# Altium schematic sheet BoardDesign.SchDoc
size Tabloid; SheetNumber: 1; SheetTotal: 1
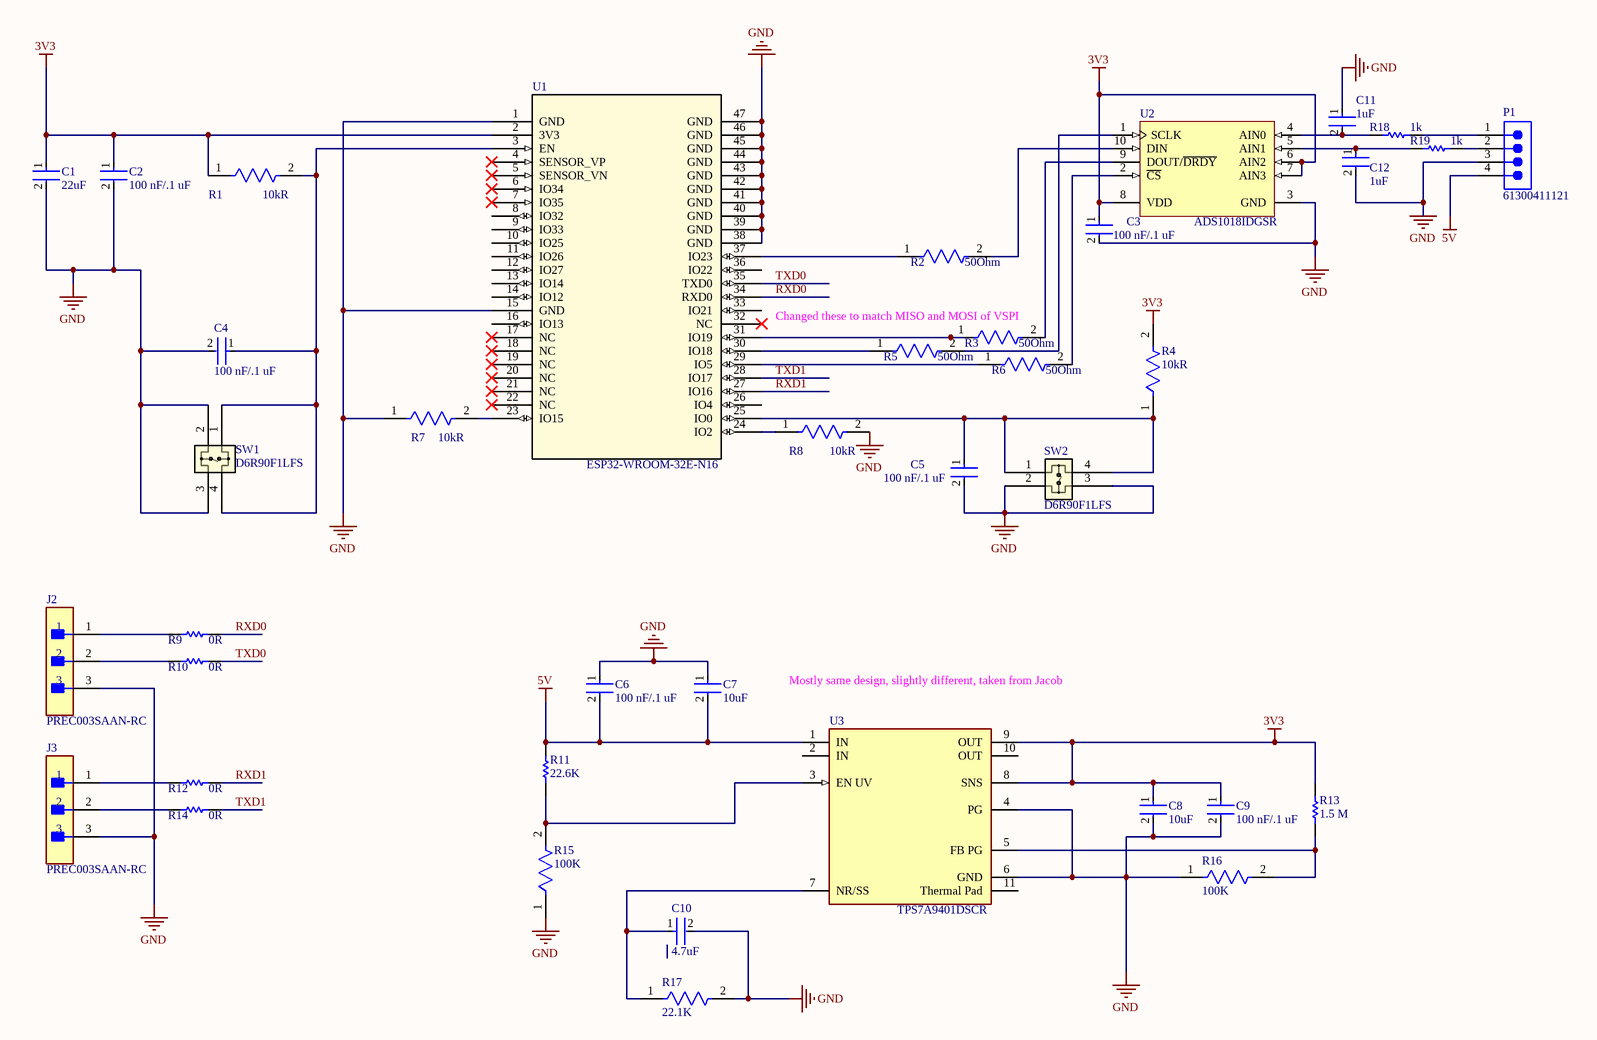
[diagram p0: BoardDesign.SchDoc]

## Parts
C1  22uF  [FP-CL21-IPC_A]
C2  100 nF/.1 uF  [FP-CC0805-0_85-MFG]
C3  100 nF/.1 uF  [FP-CC0805-0_85-MFG]
C4  100 nF/.1 uF  [FP-CC0805-0_85-MFG]
C5  100 nF/.1 uF  [FP-CC0805-0_85-MFG]
C6  100 nF/.1 uF  [FP-CC0805-0_85-MFG]
C7  10uF  [FP-CL21-IPC_B]
C8  10uF  [FP-CL21-IPC_B]
C9  100 nF/.1 uF  [FP-CC0805-0_85-MFG]
C10  4.7uF  [FP-CL21-IPC_A]
C11  1uF  [FP-CC0805-0_85-MFG]
C12  1uF  [FP-CC0805-0_85-MFG]
J2  PREC003SAAN-RC  [FP-PREC003SAAN-RC-MFG]
J3  PREC003SAAN-RC  [FP-PREC003SAAN-RC-MFG]
P1  61300411121  [61300411121]
R1  10kR  [FP-RR1220-IPC_A]
R2  50Ohm  [FP-D12-CRCW0805-MFG]
R3  50Ohm  [FP-D12-CRCW0805-MFG]
R4  10kR  [FP-RR1220-IPC_A]
R5  50Ohm  [FP-D12-CRCW0805-MFG]
R6  50Ohm  [FP-D12-CRCW0805-MFG]
R7  10kR  [FP-RR1220-IPC_A]
R8  10kR  [FP-RR1220-IPC_A]
R9  0R  [RESC2013X70X40NL20T20]
R10  0R  [RESC2013X70X40NL20T20]
R11  22.6K  [RESC2013X50X30LL20T20]
R12  0R  [RESC2013X70X40NL20T20]
R13  1.5 M  [RESC0805(2012)_N]
R14  0R  [RESC2013X70X40NL20T20]
R15  100K  [FP-RC0805-0_6-IPC_C]
R16  100K  [FP-RC0805-0_6-IPC_C]
R17  22.1K  [FP-RMCF0805-IPC_B]
R18  1k  [RESC2013X60X35ML10T20]
R19  1k  [RESC2013X60X35ML10T20]
SW1  D6R90F1LFS  [D6R_CNK]
SW2  D6R90F1LFS  [D6R_CNK]
U1  ESP32-WROOM-32E-N16  [ESP32-WROOM-32E_EXP]
U2  ADS1018IDGSR  [TI-DGS10_N]
U3  TPS7A9401DSCR  [FP-DSC0010J-MFG]

## Nets
3V3: C1.1 C2.1 C3.1 C8.1 C9.1 R1.1 R4.2 R13.2 U1.2(3V3) U2.6(AIN2) U2.7(AIN3) U2.8(VDD) U3.8(SNS) U3.9(OUT)
5V: C6.2 C7.2 P1.4 R11.1 U3.1(IN)
GND: C1.2 C2.2 C3.2 C4.2 C5.2 C6.1 C7.1 C8.2 C9.2 C10.2 C11.1 C12.2 J2.3 J3.3 P1.3 R7.1 R8.2 R15.1 R16.1 R17.2 SW1.2 SW1.3 SW2.2 SW2.3 U1.1(GND) U1.15(GND) U1.38(GND) U1.39(GND) U1.40(GND) U1.41(GND) U1.42(GND) U1.43(GND) U1.44(GND) U1.45(GND) U1.46(GND) U1.47(GND) U2.3(GND) U3.4(PG) U3.6(GND)
RXD0: R9.2 U1.34(RXD0)
RXD1: R12.2 U1.27(IO16)
TXD0: R10.2 U1.35(TXD0)
TXD1: R14.2 U1.28(IO17)
NetC4_1: C4.1 R1.2 SW1.1 SW1.4 U1.3(EN)
NetC5_1: C5.1 R4.1 SW2.1 SW2.4 U1.25(IO0)
NetC10_1: C10.1 R17.1 U3.7(NR/SS)
NetC11_2: C11.2 R18.1 U2.4(AIN0)
NetC12_1: C12.1 R19.1 U2.5(AIN1)
NetJ2_1: J2.1 R9.1
NetJ2_2: J2.2 R10.1
NetJ3_1: J3.1 R12.1
NetJ3_2: J3.2 R14.1
NetP1_1: P1.1 R18.2
NetP1_2: P1.2 R19.2
NetR2_1: R2.1 U1.37(IO23)
NetR2_2: R2.2 U2.10(DIN)
NetR3_1: R3.1 U1.31(IO19)
NetR3_2: R3.2 U2.9(DOUT/~{DRDY})
NetR5_1: R5.1 U1.30(IO18)
NetR5_2: R5.2 U2.1(SCLK)
NetR6_1: R6.1 U1.29(IO5)
NetR6_2: R6.2 U2.2(~{CS})
NetR7_2: R7.2 U1.23(IO15)
NetR8_1: R8.1 U1.24(IO2)
NetR11_2: R11.2 R15.2 U3.3(EN_UV)
NetR13_1: R13.1 R16.2 U3.5(FB_PG)

Not connected (* = marked no-connect by the designer): U1 4(SENSOR_VP)* 5(SENSOR_VN)* 6(IO34)* 7(IO35)* 8(IO32) 9(IO33) 10(IO25) 11(IO26) 12(IO27) 13(IO14) 14(IO12) 16(IO13) 17(NC)* 18(NC)* 19(NC)* 20(NC)* 21(NC)* 22(NC)* 26(IO4) 32(NC)* 33(IO21) 36(IO22); U3 2(IN) 10(OUT) 11(Thermal_Pad)

## Notes on the sheet
- (near R3) Changed these to match MISO and MOSI of VSPI
- Mostly same design, slightly different, taken from Jacob

## Library data of the parts
C1 = CMP-13271-000185-1: CL21 Series 0805 22uF 6.3V ±20% Tolerance X5R Multilayer Ceramic Chip Capacitor; Height: 1.25mm; Length: 2mm; Capacitance: 22uF; Mount: Surface Mount; Dielectric: X5R; Voltage Rating (DC): 6.3V; Case Code (Metric): 2012; Depth: 1.25mm; Max Operating Temperature: 85°C; Voltage Rating: 6.3V; Width: 0.049inch; Case/Package: 0805; Radiation Hardening: No; Thickness: 0.055inch; Packaging: Tape and Reel; Package Quantity: 2000; Lead Free: Lead Free; Contact Plating: Tin; Min Operating Temperature: -55°C; Case Code (Imperial): 0805; Tolerance: 20%
C2-C6 C9 = CMP-2100-03606-3: CAP CER 0.1UF 50V X7R 0805; Manufacturer Part Number: CC0805KRX7R9BB104; Manufacturer: Yageo; Tolerance: 0.1; Capacitance: 100 nF; Value: 100 nF; Material: Ceramic; Device Class L1: Passive Components; ComponentLink2Description: Datasheet; Package: CC0805-0.85; Digikey Description: CAP CER 0.1UF 50V X7R 0805; Device Class L3: Ceramic Capacitors; Temperature: -30°C to +85°C; Temperature Characteristic: X7R; Voltage Rating: 50 V; Height: 0.95mm; RoHS: TRUE; Ipc Land Pattern Name: CAPC200125X85; Device Class L2: Capacitors; Category: Cap; Temperature Range Low: -30°C; Temperature Range High: +85°C; Mouser Description: Multilayer Ceramic Capacitors MLCC - SMD/SMT 100nF 50V X7R 10%; Footprint Url: http://www.yageo.com/exep/pages/download/literatures/UPY-C_GEN_24.pdf; Automotive: No; Octopart: https://octopart.com/cc0805krx7r9bb104-yageo-192993; Lead Free: Yes; ComponentLink2URL: http://www.yageo.com/documents/recent/UPY-GPHC_Y5V_6.3V-to-50V_8.pdf
C7 C8 = CMP-2000-06102-2: CL21 Series 0805 10uF 16V ±10% Tolerance X5R Multilayer Ceramic Chip Capacitor; Dielectric: X7R; Length: 2mm; Depth: 1.25mm; Voltage: 16V; Width: 0.049inch; Capacitance: 10uF; Lead Free: Lead Free; Max Operating Temperature: 85°C; Mount: Surface Mount; Voltage Rating: 16V; Height: 1.25mm; Radiation Hardening: No; Packaging: Tape and Reel; Voltage Rating (DC): 16V; Thickness: 0.055inch; Case/Package: 0805; Case Code (Imperial): 0805; Min Operating Temperature: -55°C; Case Code (Metric): 2012; Package Quantity: 1; Tolerance: 10%
C10 = CMP-13271-002624-1: CL21 Series 0805 4.7uF 25V ±10% Tolerance X5R Multilayer Ceramic Chip Capacitor; Case Code (Imperial): 0805; Thickness: 0.055inch; Mount: Surface Mount; Case Code (Metric): 2012; Capacitance: 4.7uF; Depth: 1.25mm; Lead Free: Lead Free; Case/Package: 0805; Voltage Rating: 25V; Package Quantity: 1; Width: 0.049inch; Radiation Hardening: No; Voltage Rating (DC): 25V; Length: 2mm; Dielectric: X5R; Height: 1.25mm; Packaging: Tape and Reel; Tolerance: 10%; Min Operating Temperature: -55°C; Max Operating Temperature: 85°C
C11 C12 = CMP-03422-000001-1: CAP CER 1UF 16V X7R 0805; Manufacturer: Yageo; Manufacturer Part Number: CC0805KKX7R7BB105; Material: Ceramic; Tolerance: 0.1; Voltage Rating: 16 V; Category: Cap; Capacitance: 1 uF; ComponentLink2Description: Datasheet; Automotive: No; Temperature Range High: +85°C; RoHS: TRUE; Footprint Url: http://www.yageo.com/exep/pages/download/literatures/UPY-C_GEN_24.pdf; Mouser Description: Multilayer Ceramic Capacitors MLCC - SMD/SMT 1.0uF 16V X7R 10%; Height: 0.95mm; Ipc Land Pattern Name: CAPC200125X85; Temperature: -30°C to +85°C; Lead Free: Yes; Value: 1 uF; Temperature Characteristic: X7R; Package: CC0805-0.85; Temperature Range Low: -30°C; Device Class L1: Passive Components; Device Class L3: Ceramic Capacitors; Octopart: https://octopart.com/cc0805kkx7r7bb105-yageo-8376555; ComponentLink2URL: http://www.yageo.com/documents/recent/UPY-GPHC_Y5V_6.3V-to-50V_8.pdf; Device Class L2: Capacitors; Digikey Description: CAP CER 1UF 16V X7R 0805
J2 J3 = CMP-00595-22265080-1: PREC003SAAN-RC Conn Header Vert 3POS 2.54MM; Number of Contacts: 3; Connector Type: Male Pin; Current Rating: 3A; Height: 8.74mm; Contact Mating Length: 5.842mm; Min Operating Temperature: -40°C; Termination: Solder; Packaging: Bulk; Pitch: 2.54mm; Color: Black; Mount: Through Hole; Contact Material: Nickel, Tin; Number of Rows: 1; NexarPartId: 22265080; Max Operating Temperature: 105°C; RoHS: Compliant; Contact Plating: Tin; Number of Positions: 3
P1 = CMP-1502-01064-3: NexarPartId: 32855522; Operating Supply Voltage: 250V; Pitch: 2.54mm; Contact Resistance: 20mΩ; Number of Positions: 4; Current Rating: 3A; Connector Type: Male Pin; Gender: Male; Contact Plating: Gold; Height: 8.89mm; Lead Pitch: 2.54mm; Lead Free: Lead Free; Contact Mating Length: 5.9944mm; Number of Rows: 1; Termination: Solder; Packaging: Bulk; REACH SVHC: Unknown; Min Operating Temperature: -40°C; RoHS: Compliant; Number of Contacts: 4; Voltage Rating: 250V; Color: Black; Max Operating Temperature: 105°C; Contact Material: Copper; Mount: Through Hole; Orientation: Vertical; Number of Pins: 4
R1 R4 R7 R8 = CMP-2001-03215-2: 10kΩ ±0.5% 0.1W 1/10W Chip Resistor 0805 (2012 Metric) Thin Film; Max Power Dissipation: 100mW; Voltage Rating: 100V; Temperature Coefficient: 25ppm/°C; Size Code: 0805; RoHS Compliant: Yes; Package Quantity: 1; Resistance Tolerance: 0.5%; Depth: 1.25mm; Lead Free: Lead Free; Series: RR; Min Operating Temperature: -55°C; Weight: 0.000194oz; Width: 1.25mm; Packaging: Tape and Reel; Termination: SMD/SMT; Length: 2mm; Power Rating: 100mW; Case Code (Metric): 2012; Resistor Type: Thin Film; Height: 0.4mm; Resistance: 10kR; Case/Package: 0805; Case Code (Imperial): 0805; Technology: THIN FILM; Max Operating Temperature: 125°C; Voltage Rating (DC): 100V; Number of Terminations: 2; Tolerance: 0.5%
R2 R3 R5 R6 = CMP-00030-21390498-1: CRCW080550R0FKTA Res Thick Film 0805 50 Ohm 1% 0.125W(1/8W) ±100ppm/C Pad SMD Automotive T/R; Temperature Coefficient: 100ppm/°C; Resistance: 50Ω; Voltage Rating: 150V; Power Rating: 125mW; Length: 2mm; Case Code (Imperial): 0805; Height: 450µm; Contact Plating: Lead, Tin; Width: 1.25mm; Max Operating Temperature: 155°C; NexarPartId: 21390498; Case Code (Metric): 2012; Min Operating Temperature: -55°C; Tolerance: 1%; Case/Package: 0805; Lead Free: Contains Lead; RoHS: Non-Compliant; Composition: Thick Film; Weight: 5.499807mg
R9 R10 R12 R14 = CMP-1665-00002-5: Chip Resistor, 0 Ohm, +/- 1%, 0.125 W, -55 to 155 degC, 0805 (2012 Metric), RoHS, Tape and Reel; PartNumber: ERJ-6GEY0R00V; Tolerance: 5%; Resistance: 0 Ohm; REACH SVHC: No SVHC; Min Operating Temperature: -55 degC; Case/Package: 0805; Packaging: Tape and Reel; Package Quantity: 5000; ComponentLink1Description: Manufacturer URL; PackageDescription: 2-Pin Surface Mount Device, Body 2 x 1.25 mm; Mounting Technology: Surface Mount; Max Operating Temperature: 155 degC; Width: 1.25 mm; RoHSCompliant: True; Height: 0.6 mm; ComponentLink1URL: http://www.panasonic.com/; ComponentLink2URL: http://industrial.panasonic.com/cdbs/www-data/pdf/RDA0000/AOA0000C84.pdf; Case Code (Imperial): 0805; DatasheetVersion: 03/2015; Length: 2 mm; Case Code (Metric): 2012; ComponentLink2Description: Datasheet; Radiation Hardening: No
R11 = CMP-1013-00661-2: Manufacturer: Vishay Dale; Part Number: CRCW080522K6FKEA
R13 = CMP-1013-00150-1: 1M5 0.125W 5% 0805 (2012 Metric)  SMD; Value: 1500000.00 Ohm; Case-Metric: 2012; Case-EIA: 0805; Tolerance: 5 %; Technology: SMT; Power: 0.125 W
R15 R16 = CMP-2100-03668-5: RES 100K OHM 1% 1/8W 0805; Power Rating: 125mW; Temperature Coefficient: 100ppm/°C; Voltage Rating (DC): 150V; Resistance: 100kR; Package Quantity: 1; Case/Package: 0805; Lead Pitch: 0.4mm; Case Code (Imperial): 0805; Construction: Rectangular; Number of Terminations: 2; RoHS Compliant: Yes; Max Power Dissipation: 125mW; Tolerance: 1%; Max Operating Temperature: 155°C; Resistance Tolerance: 1%; Lead Free: Lead Free; Packaging: Tape and Reel; Resistor Type: Thick Film; Min Operating Temperature: -55°C; Case Code (Metric): 2012; Series: RC; Technology: THICK FILM; Voltage Rating: 150V; Termination: SMD/SMT; Width: 0.049inch; Number of Pins: 2; Features: Moisture Resistant; Military Standard: Not; Length: 0.079inch; Depth: 1.25mm; Size Code: 0805; Height: 0.024inch
R17 = CMP-26527-001411-1: 22.1kΩ ±1% 0.125W 0805 Thick Film Chip Resistor AEC-Q200 compliant; Resistance: 22.1kR; Temperature Coefficient: 100ppm/°C; Power Rating: 125mW; Min Operating Temperature: -55°C; Size Code: 0805; Max Operating Temperature: 155°C; Military Standard: Not; Features: Automotive AEC-Q200; Lead Free: Lead Free; Contact Plating: Tin; Tolerance: 1%; Series: RMCF; Resistor Type: Thick Film; Width: 0.049inch; Case Code (Imperial): 0805; Case/Package: 0805; Depth: 1.25mm; Mount: Surface Mount; RoHS Compliant: Yes; Max Power Dissipation: 125mW; Case Code (Metric): 2012; Height: 0.026inch; Construction: Rectangular; Number of Terminations: 2; Packaging: Tape and Reel; Radiation Hardening: No; Length: 0.079inch
R18 R19 = CMP-2100-03671-1: Chip Resistor, 1 KOhm, +/- 1%, 125 mW, -55 to 155 degC, 0805 (2012 Metric), RoHS, Tape and Reel; Manufacturer: Yageo; Temperature Coefficient: 100ppm/degreesC; Voltage Rating (DC): 150V; Max Power Dissipation: 125mW; Resistance: 1KOhm; Number of Pins: 2; Number of Terminations: 2; Datasheet URL: http://www.yageo.com/NewPortal/yageodocoutput?fileName=/pdf/R-Chip/PYu-RC_Group_51_RoHS_L_5.pdf; Length: 0.079inch; Package Description: 2-Pin Surface Mounted Device, Body 2 x 1.25 mm; Depth: 1.25mm; Height: 0.024inch; Military Standard: Not; Case/Package: 0805; Package Reference: 0805; RoHSCompliant: true; Lead Free: LeadFree; Packaging: TapeandReel; Package Quantity: 1; Datasheet Version: Rev. 5, 10/2016; Tolerance: 1%; Min Operating Temperature: -55degC; Voltage Rating: 150V; Composition: ThickFilm; Case Code (Imperial): 0805; Power Rating: 125mW; Width: 0.049inch; Case Code (Metric): 2012; Manufacturer URL: http://www.yageo.com/; Max Operating Temperature: 155degC; REACH SVHC: Unknown; Termination: SMD/SMT
SW1 SW2 = D6R90F1LFS: No Description Available; Mfr_Name: C&K Components; RefDes: RefDes; Type: Type
U1 = ESP32-WROOM-32E-N16: No Description Available; Mfr_Name: Espressif Systems; Type: RF; RefDes: RefDes
U2 = CMP-0003-00373-2: 12-Bit ADC with Integrated MUX, PGA, Temperature Sensor, Oscillator and Reference, -40 to 125 degC, 10-pin SOP (DGS10), Green (RoHS & no Sb/Br); Manufacturer: Texas Instruments; Resolution(Bits): 12; Digital Supply(Min)(V): 2; Analog Voltage AV/DD(Max)(V): 5.5; # Input Channels: 4; Architecture: Delta-Sigma; Interface: Serial SPI; INL(Max)(+/-LSB): 0.5; Sample Rate(max)(SPS): 3.3k; SubFamily: Precision ADC (<=10MSPS); PackageDescription: 10-Pin Plastic Small Outline, Body 3 x 3 mm, Pitch 0.5 mm; PackageVersion: 4073272/C, 02/2004; Mounting Technology: Surface Mount; DatasheetVersion: SBAS526A; ComponentLink3URL: http://www.ti.com/lit/ml/mpds035b/mpds035b.pdf; ComponentLink2URL: http://www.ti.com/lit/ds/symlink/ads1018.pdf; ComponentLink2Description: Datasheet; ComponentLink3Description: Package Specification; PartNumber: ADS1018IDGSR; ComponentLink1URL: http://www.ti.com/; ComponentLink1Description: Manufacturer URL; Code_JEDEC: MO-153; Eco-Plan: Green (RoHS & no Sb/Br); PackageReference: DGS10; Digital Supply(Max)(V): 5.5; Analog Voltage AV/DD(Min)(V): 2
U3 = CMP-04917-000380-1: 1-A, ULTRA-LOW NOISE, ULTRA-HIGH